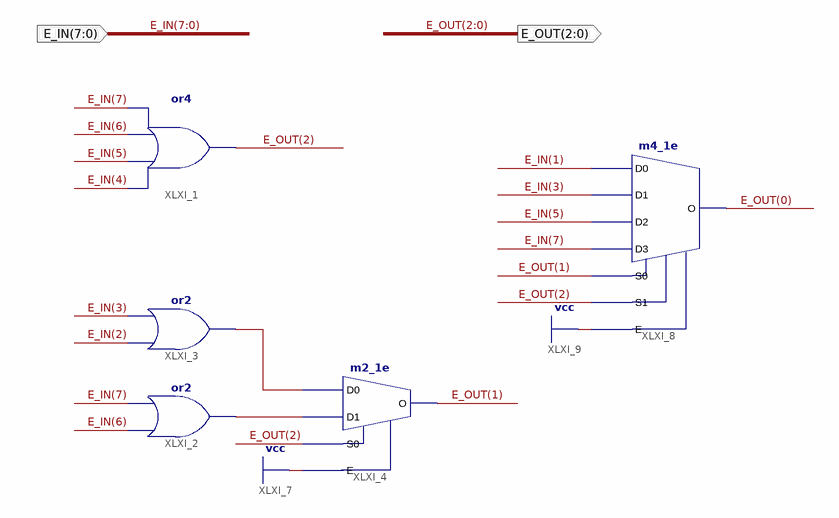
[diagram p0: schematic sheet 1]
// Xilinx ISE schematic encoder83.sch (artix7) as structural Verilog: 5 symbols, 2 ports
module encoder83 (
  input  [7:0] E_IN,
  output [2:0] E_OUT
);

  wire XLXN_17, XLXN_18;

  or XLXI_1 (E_OUT[2], E_IN[4], E_IN[5], E_IN[6], E_IN[7]);
  or XLXI_3 (XLXN_18, E_IN[2], E_IN[3]);
  m2_1e XLXI_4 (.D0(XLXN_18), .D1(XLXN_17), .E(1'b1), .S0(E_OUT[2]), .O(E_OUT[1]));
  or XLXI_2 (XLXN_17, E_IN[6], E_IN[7]);
  m4_1e XLXI_8 (
    .D0(E_IN[1]), .D1(E_IN[3]), .D2(E_IN[5]), .D3(E_IN[7]), .E(1'b1), .S0(E_OUT[1]), .S1(E_OUT[2]),
    .O(E_OUT[0]));
endmodule
